# Altium schematic sheet Main_7.SchDoc
size 400 x 200 mm; SheetNumber: 10; SheetTotal: 12
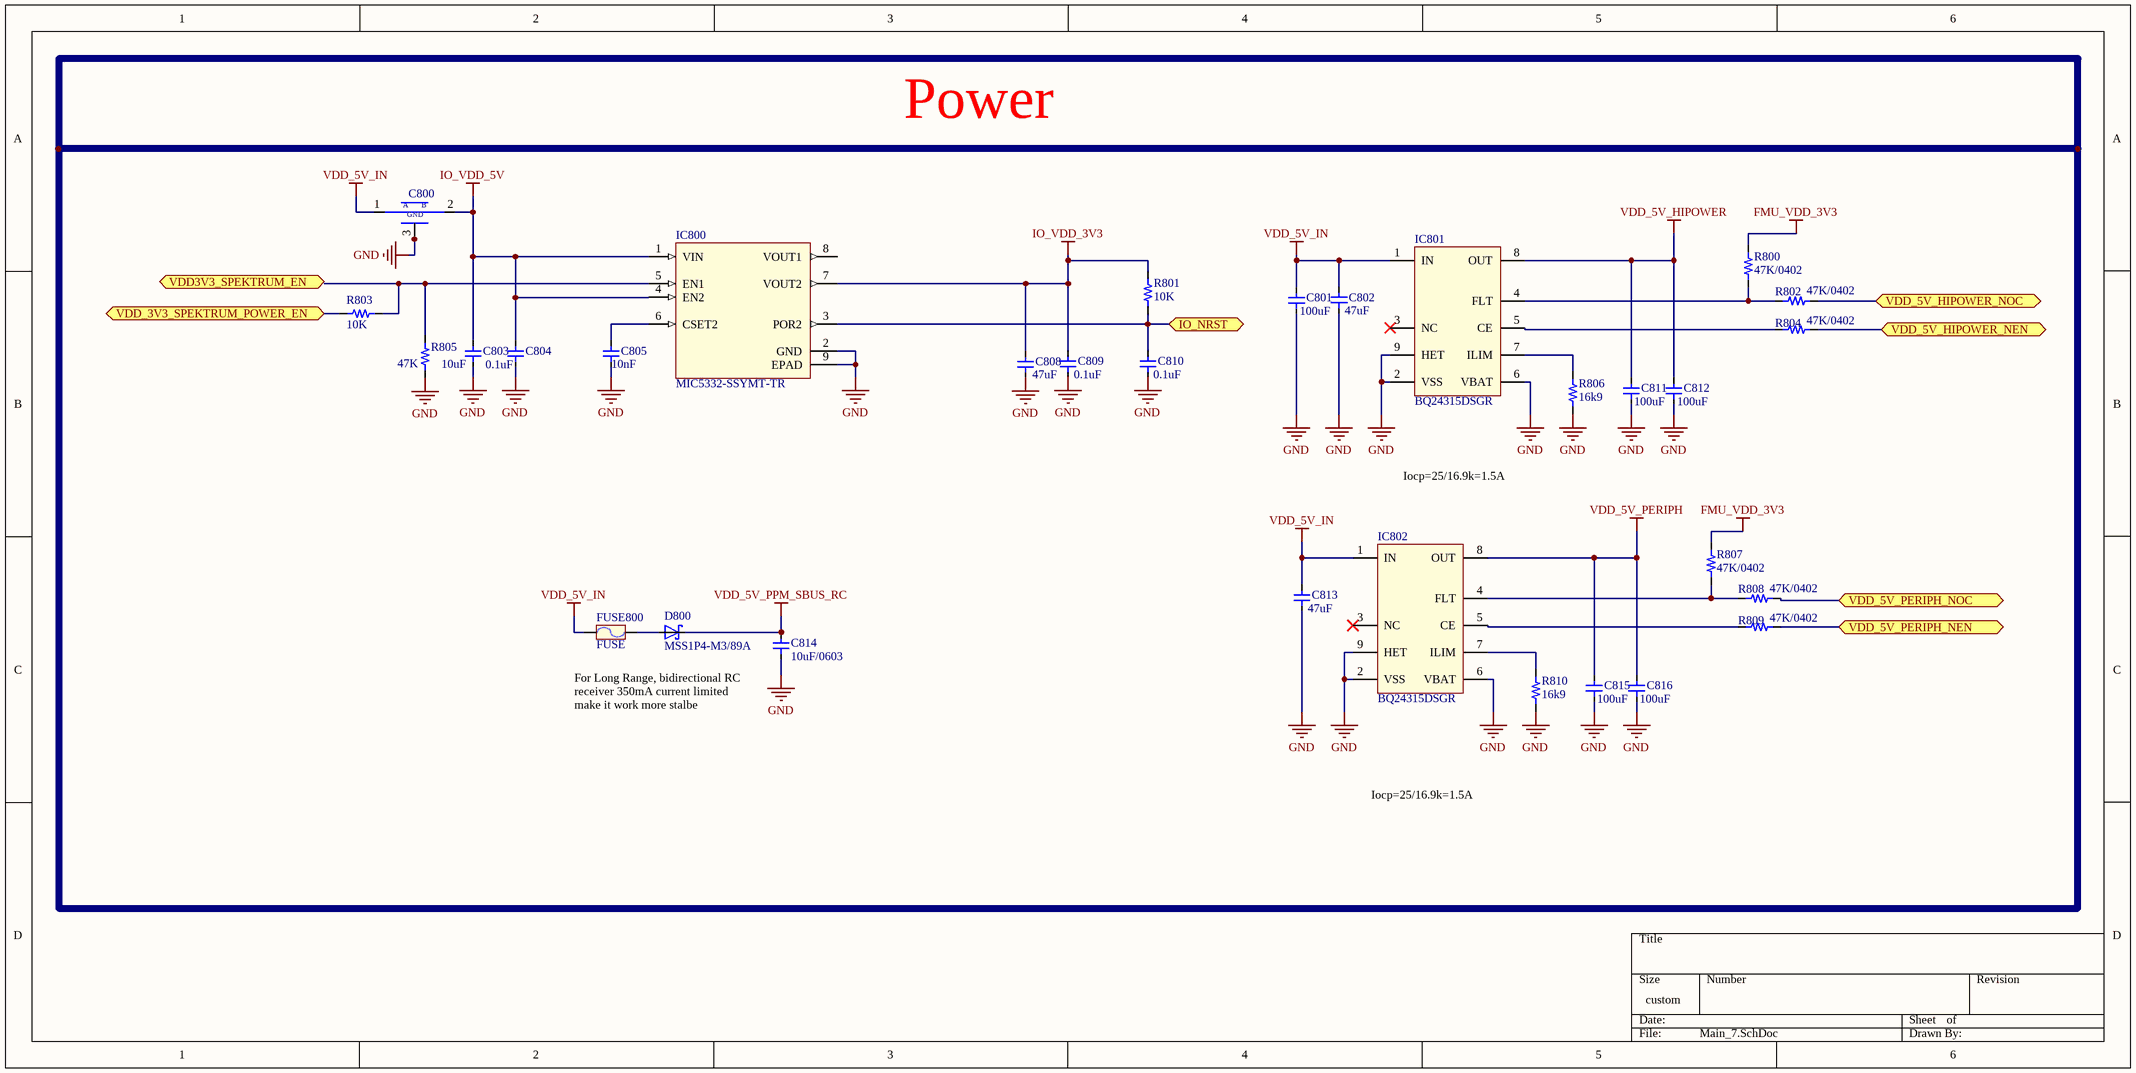
[diagram p0: Main_7.SchDoc]

## Parts
C800  W2H13C1048AT1F  [W2H13C1048AT1F]  (value not drawn)
C801  100uF  [C1206]
C802  47uF  [C0805]
C803  10uF  [C0603]
C804  0.1uF  [C0603]
C805  10nF  [C0603]
C808  47uF  [C0805]
C809  0.1uF  [C0603]
C810  0.1uF  [C0603]
C811  100uF  [C1206]
C812  100uF  [C1206]
C813  47uF  [C0805]
C814  10uF/0603  [C0603]
C815  100uF  [C1206]
C816  100uF  [C1206]
D800  MSS1P4-M3/89A  [MSS1P4-M3/89A]
FUSE800  FUSE  [FUSE_1206]
IC800  MIC5332-SSYMT-TR  [8-UFDFN]
IC801  BQ24315DSGR  [WSON-8]
IC802  BQ24315DSGR  [WSON-8]
R800  47K/0402  [R0402]
R801  10K  [R0402]
R802  47K/0402  [R0402]
R803  10K  [R0402]
R804  47K/0402  [R0402]
R805  47K  [R0402]
R806  16k9  [R0402]
R807  47K/0402  [R0402]
R808  47K/0402  [R0402]
R809  47K/0402  [R0402]
R810  16k9  [R0402]

## Ports
IO_NRST (bidir), VDD3V3_SPEKTRUM_EN (bidir), VDD_3V3_SPEKTRUM_POWER_EN (bidir), VDD_5V_HIPOWER_NEN (bidir), VDD_5V_HIPOWER_NOC (bidir), VDD_5V_PERIPH_NEN (bidir), VDD_5V_PERIPH_NOC (bidir)

## Nets
FMU_VDD_3V3: R800.1 R807.1
GND: C800.3 C800.4 C801.1 C802.1 C803.1 C804.1 C805.1 C808.1 C809.1 C810.1 C811.1 C812.1 C813.1 C814.1 C815.1 C816.1 IC800.2(GND) IC800.9(EPAD) IC801.2(VSS) IC801.6(VBAT) IC801.9(HET) IC802.2(VSS) IC802.6(VBAT) IC802.9(HET) R805.1 R806.1 R810.1
IO_VDD_3V3: C808.2 C809.2 IC800.7(VOUT2) R801.2
IO_VDD_5V: C800.2 C803.2 C804.2 IC800.1(VIN) IC800.4(EN2)
VDD_5V_HIPOWER: C811.2 C812.2 IC801.8(OUT)
VDD_5V_IN: C800.1 C801.2 C802.2 C813.2 FUSE800.1 IC801.1(IN) IC802.1(IN)
VDD_5V_PERIPH: C815.2 C816.2 IC802.8(OUT)
VDD_5V_PPM_SBUS_RC: C814.2 D800.1(C)
IO_NRST: C810.2 IC800.3(POR2) R801.1 ; port IO_NRST
VDD_3V3_SPEKTRUM_POWER_EN: R803.1 ; port VDD_3V3_SPEKTRUM_POWER_EN
VDD_5V_HIPOWER_NEN: R804.2 ; port VDD_5V_HIPOWER_NEN
VDD_5V_HIPOWER_NOC: R802.2 ; port VDD_5V_HIPOWER_NOC
VDD_5V_PERIPH_NEN: R809.2 ; port VDD_5V_PERIPH_NEN
VDD_5V_PERIPH_NOC: R808.2 ; port VDD_5V_PERIPH_NOC
NetC805_2: C805.2 IC800.6(CSET2)
NetD800_2: D800.2(A) FUSE800.2
NetIC800_5: IC800.5(EN1) R803.2 R805.2
NetIC801_4: IC801.4(FLT) R800.2 R802.1
NetIC801_5: IC801.5(CE) R804.1
NetIC801_7: IC801.7(ILIM) R806.2
NetIC802_4: IC802.4(FLT) R807.2 R808.1
NetIC802_5: IC802.5(CE) R809.1
NetIC802_7: IC802.7(ILIM) R810.2

Not connected (* = marked no-connect by the designer): IC800 8(VOUT1); IC801 3(NC)*; IC802 3(NC)*

## Notes on the sheet
- Power
- Iocp=25/16.9k=1.5A
- For Long Range, bidirectional RC receiver 350mA current limited make it work more stalbe
- (in symbol W2H13C1048AT1F) A; B; GND

## Library data of the parts
C800 = W2H13C1048AT1F: Feed Through Capacitors 25V 0.1uF X7R
C801 C811 C812 C815 C816 = CC1206MKX5R5BB107: 100 µF ±20% 6.3V Ceramic Capacitor X5R 1206 (3216 Metric)
C802 C808 C813 = GRM21BR61A476ME15L: 47 µF ±20% 10V Ceramic Capacitor X5R 0805 (2012 Metric)
C803 C814 = CC0603KRX5R6BB106: 10 µF ±10% 10V Ceramic Capacitor X5R 0603 (1608 Metric)
C804 C809 C810 = CC0603KRX7R8BB104: CAP CER 0.1UF 25V X7R 0603
C805 = CC0603JRX7R8BB103: 10000 pF ±5% 25V Ceramic Capacitor X7R 0603 (1608 Metric)
D800 = MSS1P4-M3/89A: Diode 40 V 1A Surface Mount DO-219AD (MicroSMP)
FUSE800 = NANOSMDC035F-2: Polymeric PTC Resettable Fuse 16V 350 mA Ih Surface Mount 1206 (3216 Metric), Concave
IC801 IC802 = BQ24315DSGR: Overvoltage & Overcurrent Protection IC & Li+ Charger Front-End Protection IC
R800 R802 R804 R805 R807-R809 = RC0402FR-0747KL: 47 kOhms ±1% 0.063W, 1/16W Chip Resistor 0402 (1005 Metric) Moisture Resistant Thick Film
R801 R803 = RC1005F103CS: RES SMD 10K OHM 1% 1/16W 0402
R806 R810 = RC0402FR-0716K9L: 16.9 kOhms ±1% 0.063W, 1/16W Chip Resistor 0402 (1005 Metric) Moisture Resistant Thick Film